# EAGLE design ESP32-RFID IoT V2 (EAGLE 9.6.2)
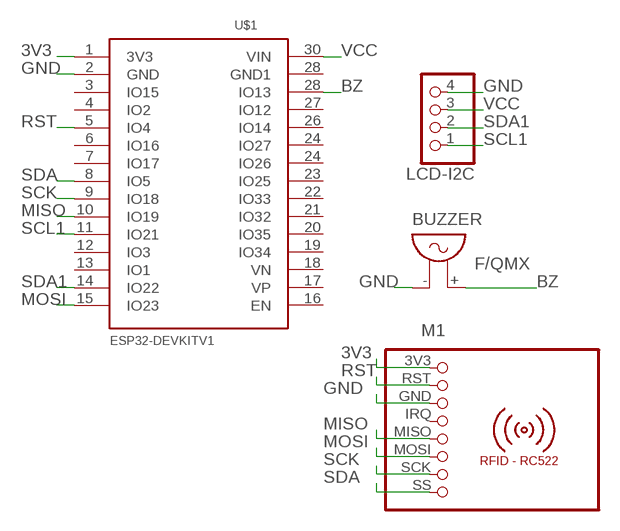
[diagram p0: schematic, sheet 1]

## Parts
BUZZER  F/QMX  [F/QMX]
LCD-I2C  PINHD-1X4  [1X04]
M1  RFID-RC522  [RFID-RC522]
U$1  ESP32DEVKITV1  [ESP32-DEVKITV1]

## Nets
3V3: M1.3V3 U$1.1(3V3)
BZ: BUZZER.+ U$1.28(IO13)
GND: BUZZER.- LCD-I2C.4 M1.GND U$1.2(GND)
MISO: M1.MISO U$1.10(IO19)
MOSI: M1.MOSI U$1.15(IO23)
RST: M1.RST U$1.5(IO4)
SCK: M1.SCK U$1.9(IO18)
SCL1: LCD-I2C.1 U$1.11(IO21)
SDA: M1.SS U$1.8(IO5)
SDA1: LCD-I2C.2 U$1.14(IO22)
VCC: LCD-I2C.3 U$1.30(VIN)
Unconnected: M1.IRQ U$1.3(IO15) U$1.4(IO2) U$1.6(IO16) U$1.7(IO17) U$1.12(IO3) U$1.13(IO1) U$1.16(EN) U$1.17(VP) U$1.18(VN) U$1.19(IO34) U$1.20(IO35) U$1.21(IO32) U$1.22(IO33) U$1.23(IO25) U$1.24(IO26) U$1.24(IO27) U$1.26(IO14) U$1.27(IO12) U$1.28(GND1)

## Library data of the parts
BUZZER = buzzer:F/QMX: BUZZER Source: Buerklin; OC_FARNELL: unknown; OC_NEWARK: unknown
LCD-I2C = pinhead:PINHD-1X4: PIN HEADER
M1 = mfrc522-module:RFID-RC522: RFID-RC522 MFRC-522 based breakout board
U$1 = ESP32-DEVKITV1:ESP32DEVKITV1

## Board
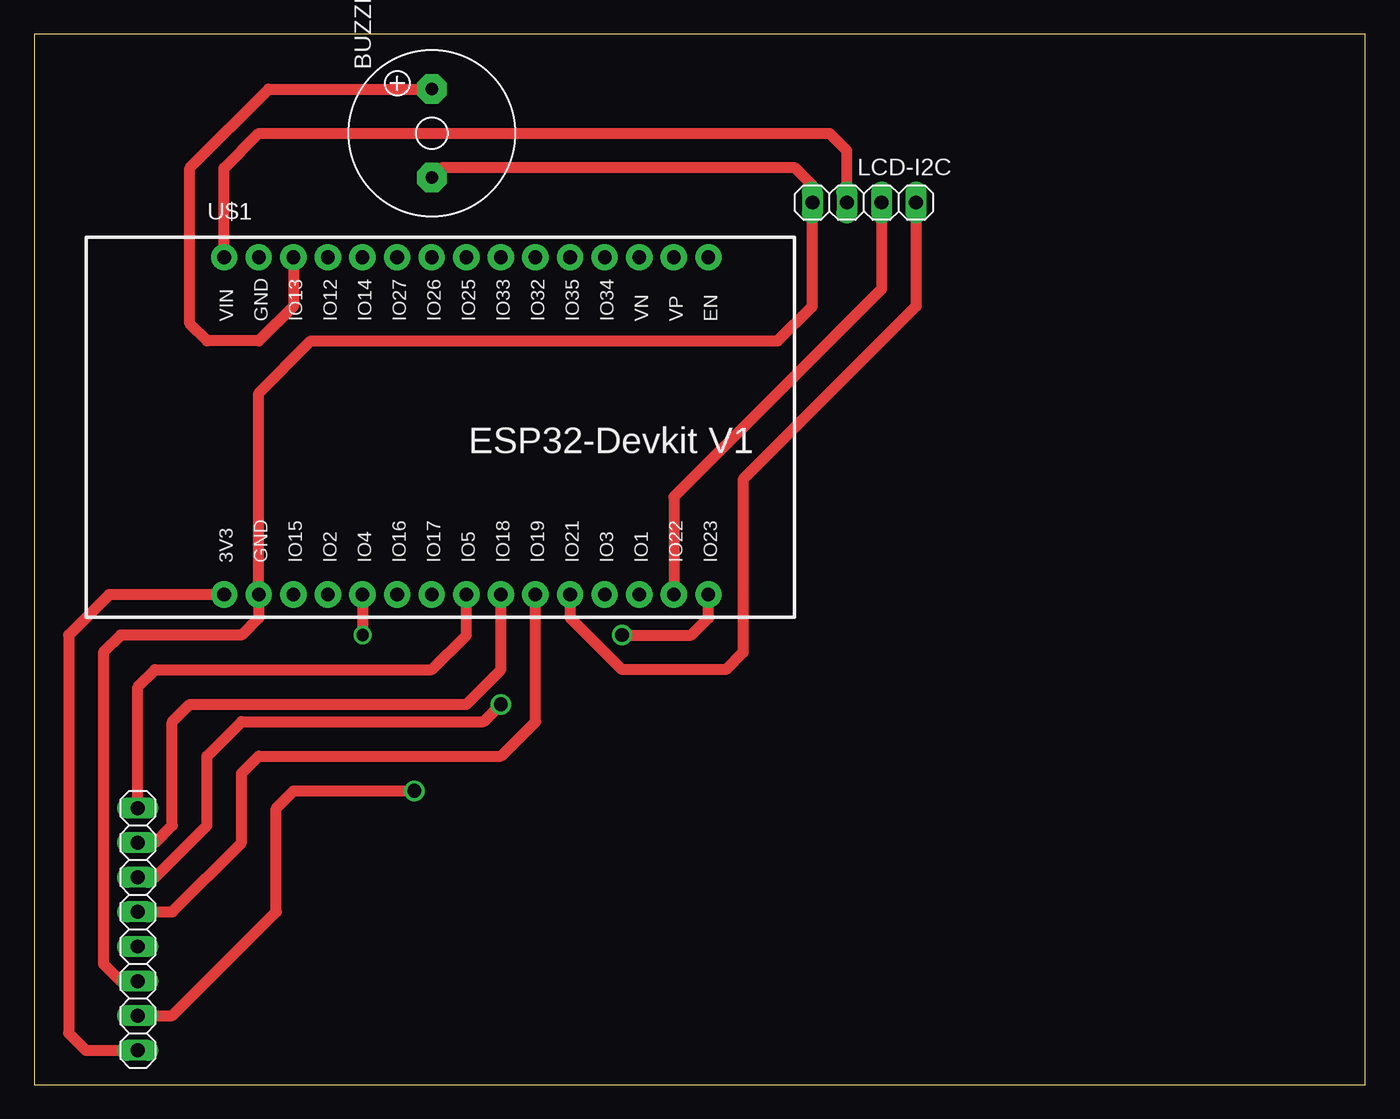
[diagram p1: board, top side]
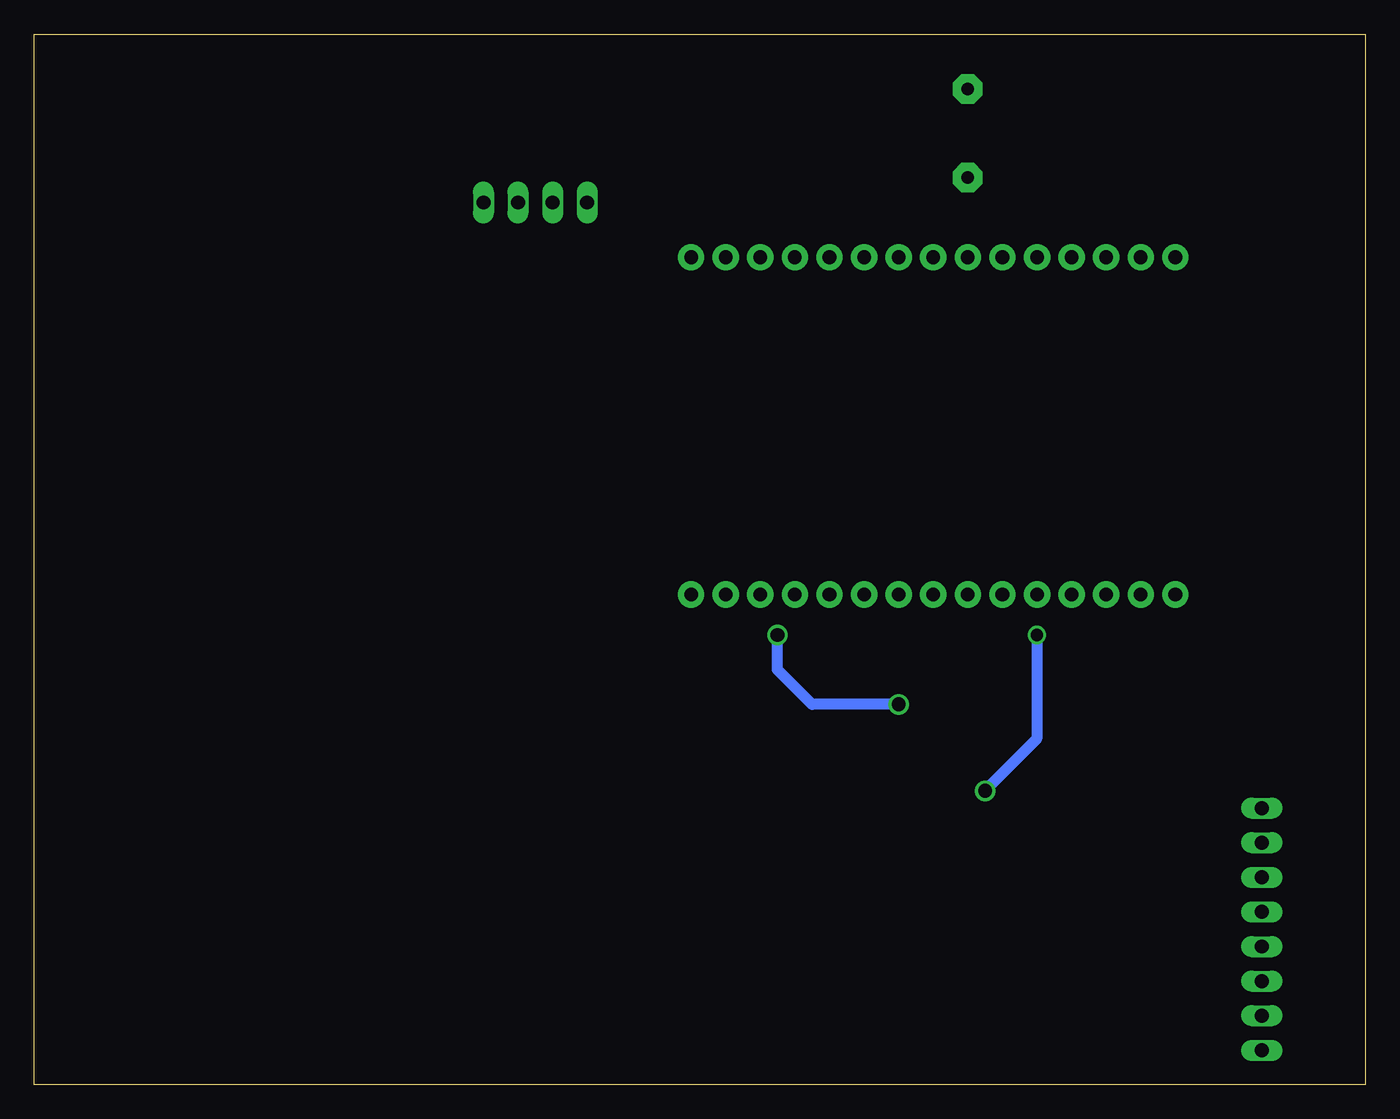
[diagram p2: board, bottom side, seen from below]

Size 97.77 x 77.14 mm. Coordinates in mm from the lower left corner, seen from the top.
Outline: 0,0 97.77,0 97.77,77.14 0,77.14 0,0
Copper layers (1*16): Top 0.035mm / dielectric 1.5mm / Bottom 0.035mm
Design rules "default": minimum track width 6mil, minimum drill 0.35mm, track to track 6mil, track to pad 6mil, pad to pad 6mil, via to via 6mil, smd to smd 6mil, copper to edge 40mil, drill to drill 6mil, minimum pad ring 10mil, minimum via ring 8mil, stop-mask expansion 4mil, vias tented up to drill 0mil, thermal gap 10mil

### Footprints (pad centres in the part's own frame; a part is rotated, then mirrored left to right if it is on the bottom)
F/QMX = drill 0.914 pad 2.159 octagon: + 3.251,0; - -3.251,0
1X04 = drill 1.016 long: 1 -3.81,0; 2 -1.27,0; 3 1.27,0; 4 3.81,0
RFID-RC522 = drill 1.016 long: 3V3 -8.89,0; GND -3.81,0; IRQ -1.27,0; MISO 1.27,0; MOSI 3.81,0; RST -6.35,0; SCK 6.35,0; SS 8.89,0
ESP32-DEVKITV1 = drill 1 pad 1.93: 1 -22.87,-13.54; 2 -20.33,-13.54; 3 -17.79,-13.54; 4 -15.25,-13.54; 5 -12.71,-13.54; 6 -10.17,-13.54; 7 -7.63,-13.54; 8 -5.09,-13.54; 9 -2.55,-13.54; 10 -0.01,-13.54; 11 2.53,-13.54; 12 5.07,-13.54; 13 7.61,-13.54; 14 10.15,-13.54; 15 12.69,-13.54; 16 12.69,11.23; 17 10.15,11.23; 18 7.61,11.23; 19 5.07,11.23; 20 2.53,11.23; 21 -0.01,11.23; 22 -2.55,11.23; 23 -5.09,11.23; 24 -7.63,11.23; 25 -10.17,11.23; 26 -12.71,11.23; 27 -15.25,11.23; 28 -17.79,11.23; 29 -20.33,11.23; 30 -22.87,11.23

### Placement (x,y rotation side)
BUZZER  29.21,69.85 90 top
LCD-I2C  60.96,64.77 180 top
M1  7.62,11.43 90 top
U$1  36.83,49.53 0 top

### Tracks (layer width: path | path; a pad name or v marks a point on that pad's centre or on a via)
3V3
  Top 0.813: U$1.1 5.51,35.99 2.54,33.02 2.54,3.81 3.81,2.54 M1.3V3
BZ
  Top 0.813: U$1.28 19.05,57.15 16.51,54.61 12.7,54.61 11.43,55.88 11.43,67.31 17.22,73.1 BUZZER.+
GND
  Top 0.813: BUZZER.- 29.92,67.31 55.88,67.31 57.15,66.04 LCD-I2C.4 57.15,57.15 54.61,54.61 20.32,54.61 16.5,50.79 U$1.2 16.5,34.3 16.51,34.29 15.24,33.02 6.35,33.02 5.08,31.75 5.08,8.89 6.35,7.62 M1.GND
MISO
  Top 0.813: U$1.10 36.83,26.67 34.29,24.13 16.51,24.13 15.24,22.86 15.24,17.78 10.16,12.7 M1.MISO
MOSI  (via drill 0.85, 1)
  Top 0.813: M1.MOSI 8.89,15.24 12.7,19.05 12.7,24.13 15.24,26.67 33.02,26.67 v34.29,27.94 | v43.18,33.02 48.26,33.02 49.53,34.29 U$1.15
  Bottom 0.813: v34.29,27.94 40.64,27.94 43.18,30.48 v43.18,33.02
RST  (via drill 0.9, 1)
  Top 0.813: M1.RST 10.16,5.08 17.78,12.7 17.78,20.32 19.05,21.59 v27.94,21.59 | U$1.5 v24.13,33.02
  Bottom 0.813: v24.13,33.02 24.13,25.4 v27.94,21.59
SCK
  Top 0.813: M1.SCK 8.89,17.78 10.16,19.05 10.16,26.67 11.43,27.94 31.75,27.94 34.29,30.48 U$1.9
SCL1
  Top 0.813: U$1.11 39.37,34.29 43.18,30.48 50.8,30.48 52.07,31.75 52.07,44.45 64.77,57.15 LCD-I2C.1
SDA
  Top 0.813: M1.SS 7.62,29.21 8.89,30.48 29.21,30.48 31.75,33.02 U$1.8
SDA1
  Top 0.813: LCD-I2C.2 62.23,58.42 46.98,43.17 U$1.14
VCC
  Top 0.813: U$1.30 13.96,67.3 16.51,69.85 58.42,69.85 59.69,68.58 LCD-I2C.3